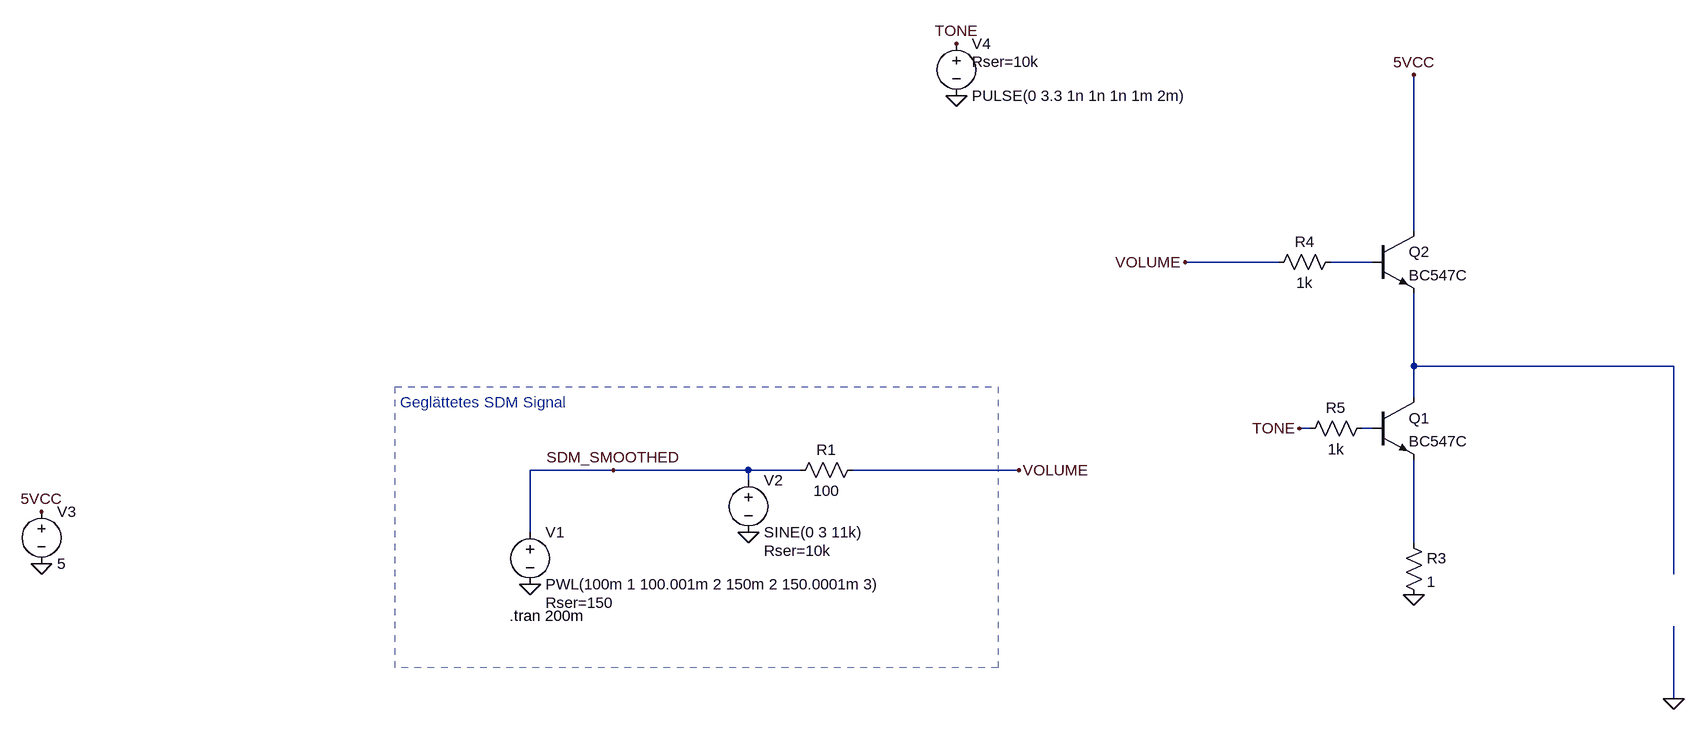
[diagram p0: schematic smoothing_SD_DAC_V3.asc]
smoothing_SD_DAC_V3.asc, the LTspice schematic file:
Version 4
SHEET 1 2228 680
WIRE 1424 -304 1424 -544
WIRE 1216 -256 1072 -256
WIRE 1360 -256 1296 -256
WIRE 1424 -96 1424 -208
WIRE 1824 -96 1424 -96
WIRE 1424 -48 1424 -96
WIRE 1264 0 1248 0
WIRE 1360 0 1344 0
WIRE 192 64 64 64
WIRE 400 64 192 64
WIRE 480 64 400 64
WIRE 816 64 560 64
WIRE 400 80 400 64
WIRE 64 160 64 64
WIRE 1424 176 1424 48
WIRE 1824 224 1824 -96
WIRE 1824 416 1824 304
FLAG 64 240 0
FLAG -688 208 0
FLAG -688 128 5VCC
FLAG 400 160 0
FLAG 1824 416 0
FLAG 816 64 VOLUME
FLAG 1248 0 TONE
FLAG 720 -512 0
FLAG 720 -592 TONE
FLAG 1424 256 0
FLAG 192 64 SDM_SMOOTHED
FLAG 1424 -544 5VCC
FLAG 1072 -256 VOLUME
SYMBOL voltage 64 144 R0
WINDOW 123 0 0 Left 0
WINDOW 39 24 124 Left 2
SYMATTR SpiceLine Rser=150
SYMATTR InstName V1
SYMATTR Value PWL(100m 1 100.001m 2 150m 2 150.0001m 3)
SYMBOL voltage 400 64 R0
WINDOW 123 0 0 Left 0
WINDOW 39 24 124 Left 2
SYMATTR SpiceLine Rser=10k
SYMATTR InstName V2
SYMATTR Value SINE(0 3 11k)
SYMBOL res 576 48 R90
WINDOW 0 0 56 VBottom 2
WINDOW 3 32 56 VTop 2
SYMATTR InstName R1
SYMATTR Value 100
SYMBOL voltage -688 112 R0
WINDOW 123 0 0 Left 0
WINDOW 39 0 0 Left 0
SYMATTR InstName V3
SYMATTR Value 5
SYMBOL npn 1360 -48 R0
SYMATTR InstName Q1
SYMATTR Value BC547C
SYMBOL voltage 720 -608 R0
WINDOW 123 0 0 Left 0
WINDOW 39 24 44 Left 2
SYMATTR SpiceLine Rser=10k
SYMATTR InstName V4
SYMATTR Value PULSE(0 3.3 1n 1n 1n 1m 2m)
SYMBOL res 1408 160 R0
SYMATTR InstName R3
SYMATTR Value 1
SYMBOL npn 1360 -304 R0
SYMATTR InstName Q2
SYMATTR Value BC547C
SYMBOL res 1312 -272 R90
WINDOW 0 0 56 VBottom 2
WINDOW 3 32 56 VTop 2
SYMATTR InstName R4
SYMATTR Value 1k
SYMBOL res 1360 -16 R90
WINDOW 0 0 56 VBottom 2
WINDOW 3 32 56 VTop 2
SYMATTR InstName R5
SYMATTR Value 1k
TEXT 32 288 Left 2 !.tran 200m
TEXT -136 -40 Left 2 ;Geglättetes SDM Signal
RECTANGLE Normal 784 368 -144 -64 2

The netlist it stands for:
* smoothing_SD_DAC_V3.asc
V1 SDM_SMOOTHED 0 PWL(100m 1 100.001m 2 150m 2 150.0001m 3) Rser=150
V2 SDM_SMOOTHED 0 SINE(0 3 11k) Rser=10k
R1 VOLUME SDM_SMOOTHED 100
V3 5VCC 0 5
Q1 N002 N003 N004 0 BC547C
V4 TONE 0 PULSE(0 3.3 1n 1n 1n 1m 2m) Rser=10k
R3 N004 0 1
Q2 5VCC N001 N002 0 BC547C
R4 N001 VOLUME 1k
R5 N003 TONE 1k
.model NPN NPN
.model PNP PNP
.lib standard.bjt
.tran 200m
* Geglättetes SDM Signal
.backanno
.end